# Altium schematic sheet controller_PA.SchDoc
size A4
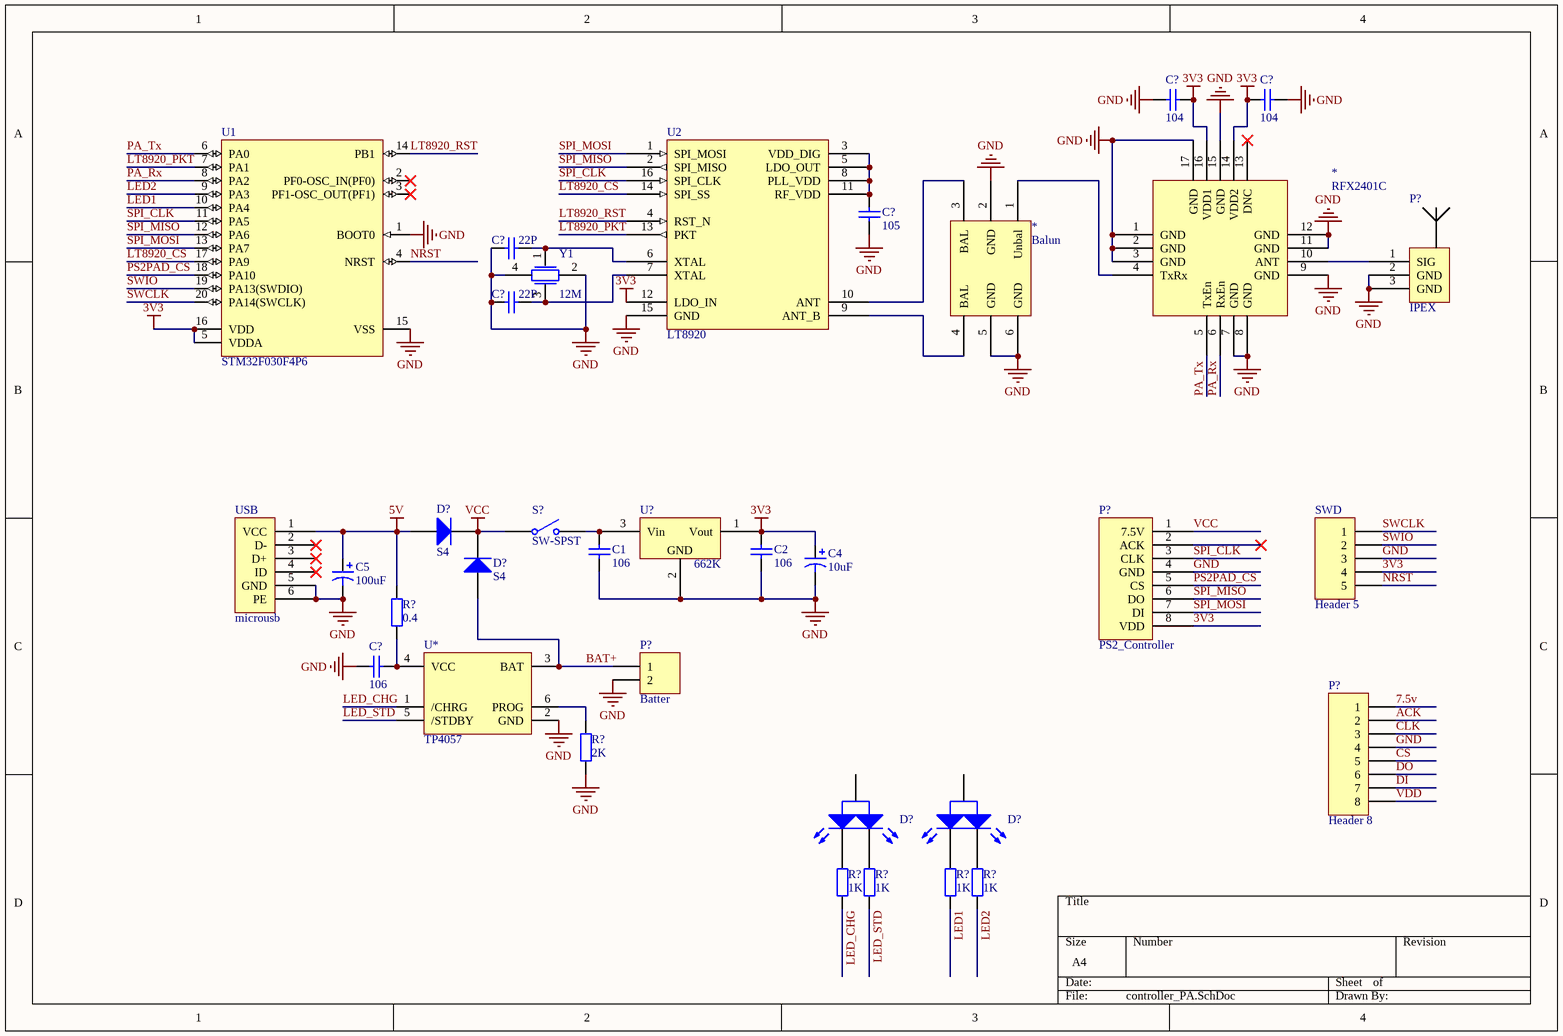
[diagram p0: controller_PA.SchDoc]

## Parts
(Parts that share a designator on the sheet are numbered #1, #2 ... from top to bottom, then left to right.)
*#1  RFX2401C  [QFN-16 - duplicate]
*#2  Balun  [Balun]
C1  106  [0805]
C2  106  [0805]
C4  10uF  [0805]
C5  100uF  [0805]
C?#1  value 104  [0805-2]  (hidden comment: Cap)
C?#2  value 104  [0805-2]  (hidden comment: Cap)
C?#3  value 105  [0805-2]  (hidden comment: Cap)
C?#4  value 22P  [0805-2]  (hidden comment: Cap)
C?#5  value 22P  [0805-2]  (hidden comment: Cap)
C?#6  value 106  [0805-2]  (hidden comment: Cap)
D?#1  S4  [SOD523]
D?#2  S4  [SOD523]
D?#3  LED1  [LED_A3]  (value not drawn)
D?#4  LED1  [LED_A3]  (value not drawn)
P?#1  IPEX  [U.FL-R-SMT]
P?#2  PS2_Controller  [HDR8X1_A]
P?#3  Batter  [HDR1X2]
P?#4  Header 8  [HDR1X8]
R?#1  value 0.4  [1210]  (hidden comment: Res1)
R?#2  value 2K  [0603-1]  (hidden comment: Res1)
R?#3  value 1K  [0603-1]  (hidden comment: Res1)
R?#4  value 1K  [0603-1]  (hidden comment: Res1)
R?#5  value 1K  [0603-1]  (hidden comment: Res1)
R?#6  value 1K  [0603-1]  (hidden comment: Res1)
S?  SW-SPST  [SPST-2]
SWD  Header 5  [HDR5*1*1.27]
U1  STM32F030F4P6  [STM-TSSOP20_N]
U2  LT8920
U*  TP4057  [SOT23-6]
U?  662K  [SOT-23]
USB  microusb  [MICROUSB_1]
Y1  12M  [XTAL_3225]

## Nets
3V3: *#1.14(VDD2) *#1.16(VDD1) C2.2 C4.1 C?#1.1 C?#2.2 P?#2.8(VDD) SWD.4 U1.5(VDDA) U1.16(VDD) U2.12(LDO_IN) U?.1(Vout)
5V: C5.1 D?#1.1(A) R?#1.2 USB.1(VCC)
GND: *#1.1(GND) *#1.2(GND) *#1.3(GND) *#1.7(GND) *#1.8(GND) *#1.9(GND) *#1.11(GND) *#1.12(GND) *#1.15(GND) *#1.17(GND) *#2.2(GND) *#2.5(GND) *#2.6(GND) C1.1 C2.1 C4.2 C5.2 C?#1.2 C?#2.1 C?#3.1 C?#4.1 C?#5.1 C?#6.2 P?#1.2(GND) P?#1.3(GND) P?#2.4(GND) P?#3.2 P?#4.4 R?#2.1 SWD.3 U1.1(BOOT0) U1.15(VSS) U2.15(GND) U*.2(GND) U?.2(Vss) USB.5(GND) USB.6(PE) Y1.2 Y1.4
VCC: D?#1.2(K) D?#2.2(K) P?#2.1(7.5V) S?.1(COMMON)
7.5v: P?#4.1
ACK: P?#4.2
BAT+: D?#2.1(A) P?#3.1 U*.3(BAT)
CLK: P?#4.3
CS: P?#4.5
DI: P?#4.7
DO: P?#4.6
LED1: R?#5.1 U1.10(PA4)
LED2: R?#6.1 U1.9(PA3)
LED_CHG: R?#3.1 U*.1(/CHRG)
LED_STD: R?#4.1 U*.5(/STDBY)
LT8920_CS: U1.17(PA9) U2.14(SPI_SS)
LT8920_PKT: U1.7(PA1) U2.13(PKT)
LT8920_RST: U1.14(PB1) U2.4(RST_N)
NRST: SWD.5 U1.4(NRST)
PA_Rx: *#1.6(RxEn) U1.8(PA2)
PA_Tx: *#1.5(TxEn) U1.6(PA0)
PS2PAD_CS: P?#2.5(CS) U1.18(PA10)
SPI_CLK: P?#2.3(CLK) U1.11(PA5) U2.16(SPI_CLK)
SPI_MISO: P?#2.6(DO) U1.12(PA6) U2.2(SPI_MISO)
SPI_MOSI: P?#2.7(DI) U1.13(PA7) U2.1(SPI_MOSI)
SWCLK: SWD.1 U1.20(PA14(SWCLK))
SWIO: SWD.2 U1.19(PA13(SWDIO))
VDD: P?#4.8
Net*#1_4: *#1.4(TxRx) *#2.1(Unbal)
Net*#1_10: *#1.10(ANT) P?#1.1(SIG)
Net*#2_3: *#2.3(BAL) U2.10(ANT)
Net*#2_4: *#2.4(BAL) U2.9(ANT_B)
NetC1_2: C1.2 S?.2(NO) U?.3(Vin)
NetC?#3_2: C?#3.2 U2.3(VDD_DIG) U2.5(LDO_OUT) U2.8(PLL_VDD) U2.11(RF_VDD)
NetC?#4_2: C?#4.2 U2.6(XTAL) Y1.1
NetC?#5_2: C?#5.2 U2.7(XTAL) Y1.3
NetC?#6_1: C?#6.1 R?#1.1 U*.4(VCC)
NetD?#3_1: D?#3.1(K1) R?#4.2
NetD?#3_3: D?#3.3(K2) R?#3.2
NetD?#4_1: D?#4.1(K1) R?#6.2
NetD?#4_3: D?#4.3(K2) R?#5.2
NetR?#2_2: R?#2.2 U*.6(PROG)

Not connected (* = marked no-connect by the designer): *#1 13(DNC)*; D?#3 2(A); D?#4 2(A); P?#2 2(ACK)*; U1 2(PF0-OSC_IN(PF0))* 3(PF1-OSC_OUT(PF1))*; USB 2(D-)* 3(D+)* 4(ID)*

## Notes on the sheet
- (in symbol 662K) GND

## Library data of the parts
*#2 = Balun: 2450BM15A0002
C1 C2 = Cap Semi: Capacitor (Semiconductor SIM Model); Published: 8-Jun-2000; LatestRevisionDate: 29-May-2009; LatestRevisionNote: IPC-7351 Footprint Added.; PackageReference: C1206; Publisher: Altium Limited; PackageDescription: Chip Capacitor; Value: 106
C4 C5 = Cap Pol3: Polarized Capacitor (Surface Mount); Value: 100pF; Published: 8-Jun-2000; LatestRevisionDate: 29-May-2009; LatestRevisionNote: IPC-7351 Footprint Added.; PackageReference: C0805; Publisher: Altium Limited; PackageDescription: Chip Capacitor
C?#1-C?#6 = Cap: 无极性电容; Published: 8-Jun-2000; LatestRevisionDate: 17-Jul-2002; LatestRevisionNote: Re-released for DXP Platform.; PackageReference: RAD-0.3; Publisher: Altium Limited
D?#1 D?#2 = Diode: Default Diode; Published: 8-Jun-2000; LatestRevisionDate: 17-Jul-2002; LatestRevisionNote: Re-released for DXP Platform.; PackageVersion: Sep-1996; PackageReference: SMC; Publisher: Altium Limited; PackageDescription: DO-214-AB/SMC; 2 C-Bend Leads; Body 7.9 x 5.9 mm, inc. leads (LxW); Code_JEDEC: DO-214-AB
D?#3 D?#4 = LED1: 双色LED; Published: 8-Jun-2000; LatestRevisionDate: 08-Jul-2005; LatestRevisionNote: Mech Layer 1 removed.; PackageReference: LED-0; Publisher: Altium Limited
P?#1 = IPEX: U.FL-R-SMT
P?#3 = Header 2: Header, 2-Pin; LatestRevisionDate: 17-Jul-2002; LatestRevisionNote: Re-released for DXP Platform.; Publisher: Altium Limited
P?#4 = Header 8: Header, 8-Pin; LatestRevisionDate: 17-Jul-2002; LatestRevisionNote: Re-released for DXP Platform.; Publisher: Altium Limited
R?#1-R?#6 = Res1: 贴片电阻; Published: 8-Jun-2000; LatestRevisionDate: 17-Jul-2002; LatestRevisionNote: Re-released for DXP Platform.; PackageReference: AXIAL-0.4; Publisher: Altium Limited
S? = SW-SPST: Single-Pole, Single-Throw Switch; Published: 24-Mar-1999; LatestRevisionDate: 17-Jul-2002; LatestRevisionNote: Re-released for DXP Platform.; PackageReference: SPST-2; Publisher: Altium Limited; PackageDescription: Switch; 2 Leads
SWD = Header 5: 接插件
U1 = STM32F030F4P6: ARM Cortex-M0 32-bit MCU, 16 KB Flash, 4 KB Internal RAM, 15 I/Os, 20-pin TSSOP, -40 to 85 degC, Tube; FLASH Size (Prog) (kB): 16; I/Os (High Current): 15; Internal RAM Size (kB): 4; Operating Frequency(F) (Processor speed) (MHz): 48; Supply Voltage(Vcc) min (V): 2.4; DatasheetVersion: Rev. 1; PackageVersion: Rev. 1, 11/2012; PackageReference: TSSOP20; PackageDescription: 20-Pin Thin Shrink Small Outline Package, 6.5 x 4.4 mm Body, 0.65 mm Pitch; Supplier 1: Digi-Key; Supplier Part Number 1: 497-14044-5-ND; Supplier 2: Newark; Supplier Part Number 2: 06X3648; Supplier 3: Mouser; Supplier Part Number 3: 511-STM32F030F4P6; Core: ARM Cortex-M0; Packing: Tube; Mounting Technology: Surface Mount; PartNumber: STM32F030F4P6; ComponentLink1Description: Manufacturer URL; ComponentLink1URL: http://www.st.com/web/en/home.html; ComponentLink2Description: Datasheet; ComponentLink2URL: http://www.st.com/st-web-ui/static/active/en/resource/technical/document/datasheet/DM00088500.pdf; ComponentLink3Description: Package Specification; ComponentLink3URL: http://www.st.com/st-web-ui/static/active/en/resource/technical/document/datasheet/DM00065136.pdf
U* = TP4057: l锂电池管理芯片
Y1 = XTAL-4PIN: 贴片晶振